# EAGLE schematic Main-board (EAGLE 9.5.2)
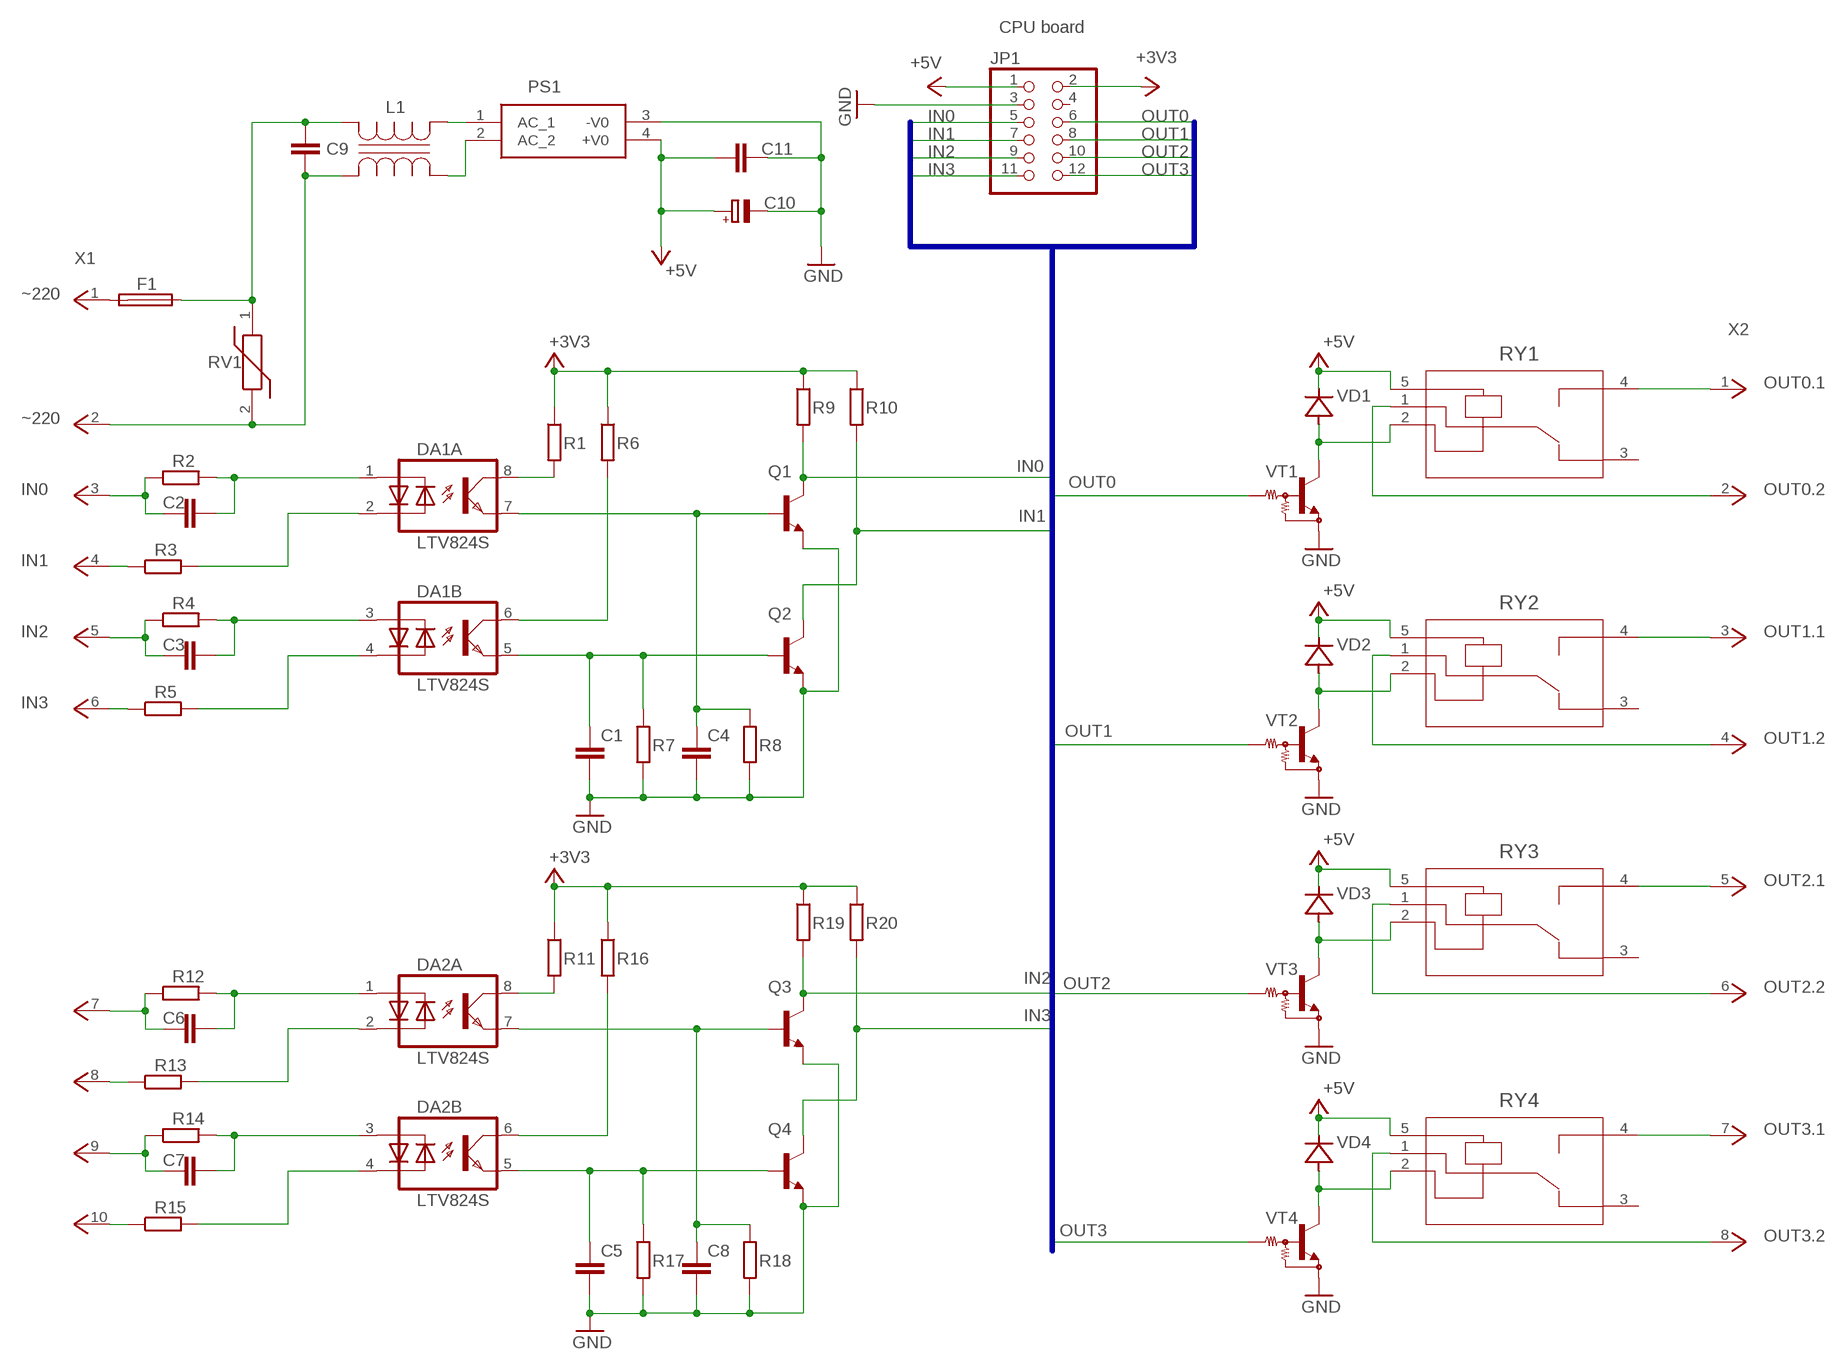
[diagram p0: schematic, sheet 1]

## Parts
C1  0,1u  C-EUC0603  [C0603]
C2  33n  C-EUC1812  [C1812]
C3  33n  C-EUC1812  [C1812]
C4  0,1u  C-EUC0603  [C0603]
C5  0,1u  C-EUC0603  [C0603]
C6  33n  C-EUC1812  [C1812]
C7  33n  C-EUC1812  [C1812]
C8  0,1u  C-EUC0603  [C0603]
C9  R46KI310000M1K  [CAP_R46KI310000M1K]
C10  220uF  CPOL-EUD/7343-31W  [D/7343-31W]
C11  0,1u  C-EUC0603  [C0603]
DA1  LTV824S  [DIL8-SMD]
DA2  LTV824S  [DIL8-SMD]
F1  0,5A  TR5  [TR5]
JP1  NOT INSTALLED  PINHD-2X6  [2X06]
L1  DLW5BSN152SQ2L  [IND_DLW5BS_2020]
PS1  HLK-10M05  [HLK10M05]
Q1  BC847ALT1SMD  [SOT23]
Q2  BC847ALT1SMD  [SOT23]
Q3  BC847ALT1SMD  [SOT23]
Q4  BC847ALT1SMD  [SOT23]
R1  2,2k  R-EU_R0603  [R0603]
R2  330k  R-EU_R2512  [R2512]
R3  51  R-EU_R2512  [R2512]
R4  330 k  R-EU_R2512  [R2512]
R5  51  R-EU_R2512  [R2512]
R6  2,2k  R-EU_R0603  [R0603]
R7  33k  R-EU_R0603  [R0603]
R8  33k  R-EU_R0603  [R0603]
R9  10k  R-EU_R0603  [R0603]
R10  10k  R-EU_R0603  [R0603]
R11  2,2k  R-EU_R0603  [R0603]
R12  330k  R-EU_R2512  [R2512]
R13  51  R-EU_R2512  [R2512]
R14  330 k  R-EU_R2512  [R2512]
R15  51  R-EU_R2512  [R2512]
R16  2,2k  R-EU_R0603  [R0603]
R17  33k  R-EU_R0603  [R0603]
R18  33k  R-EU_R0603  [R0603]
R19  10k  R-EU_R0603  [R0603]
R20  10k  R-EU_R0603  [R0603]
RV1  VDR-10D561KJ  [VDR10D561KJ]
RY1  SRD-05VDC-SL-C  [RELAY_SRD-05VDC-SL-C]
RY2  SRD-05VDC-SL-C  [RELAY_SRD-05VDC-SL-C]
RY3  SRD-05VDC-SL-C  [RELAY_SRD-05VDC-SL-C]
RY4  SRD-05VDC-SL-C  [RELAY_SRD-05VDC-SL-C]
VD1  LL4148  [SOD80C]
VD2  LL4148  [SOD80C]
VD3  LL4148  [SOD80C]
VD4  LL4148  [SOD80C]
VT1  BCR108E6327  [SOT23_1]
VT2  BCR108E6327  [SOT23_1]
VT3  BCR108E6327  [SOT23_1]
VT4  BCR108E6327  [SOT23_1]
X1  2EHDCR-5.08-10P  [2EHDCR-5.08-10P]
X2  2EHDCR-5.08-08P  [2EHDCR-5.08-08P]

## Nets
+3V3: JP1.2 R1.1 R6.1 R9.1 R10.1 R11.1 R16.1 R19.1 R20.1
+5V: C10.+ C11.1 JP1.1 PS1.4(+V0) RY1.5 RY2.5 RY3.5 RY4.5 VD1.C VD2.C VD3.C VD4.C
GND: C1.2 C4.2 C5.2 C8.2 C10.- C11.2 JP1.3 PS1.3(-V0) Q1.2(E) Q2.2(E) Q3.2(E) Q4.2(E) R7.2 R8.2 R17.2 R18.2 VT1.2 VT2.2 VT3.2 VT4.2
IN0: JP1.5 Q1.3(C) R9.2
IN1: JP1.7 Q2.3(C) R10.2
IN2: JP1.9 Q3.3(C) R19.2
IN3: JP1.11 Q4.3(C) R20.2
N$1: C2.1 R2.1 X1.3
N$2: C2.2 DA1.1(A:A) R2.2
N$3: DA1.2(A:C) R3.2
N$4: R3.1 X1.4
N$5: C3.1 R4.1 X1.5
N$6: C3.2 DA1.3(B:A) R4.2
N$7: DA1.4(B:C) R5.2
N$8: R5.1 X1.6
N$9: DA1.8(A:COL) R1.2
N$10: DA1.6(B:COL) R6.2
N$11: C1.1 DA1.5(B:EMIT) Q2.1(B) R7.1
N$12: C9.2 F1.1 L1.1 RV1.1
N$13: L1.2 PS1.1(AC_1)
N$14: C4.1 DA1.7(A:EMIT) Q1.1(B) R8.1
N$15: L1.3 PS1.2(AC_2)
N$16: F1.2 X1.1
N$17: C6.1 R12.1 X1.7
N$18: C6.2 DA2.1(A:A) R12.2
N$19: DA2.2(A:C) R13.2
N$20: C7.1 R14.1 X1.9
N$21: C7.2 DA2.3(B:A) R14.2
N$22: DA2.4(B:C) R15.2
N$23: DA2.8(A:COL) R11.2
N$24: DA2.6(B:COL) R16.2
N$25: C5.1 DA2.5(B:EMIT) Q4.1(B) R17.1
N$26: C9.1 L1.4 RV1.2 X1.2
N$28: C8.1 DA2.7(A:EMIT) Q3.1(B) R18.1
N$31: R13.1 X1.8
N$32: R15.1 X1.10
N$33: RY2.2 VD2.A VT2.3
N$34: RY1.2 VD1.A VT1.3
N$35: RY3.2 VD3.A VT3.3
N$36: RY4.2 VD4.A VT4.3
N$37: RY1.4 X2.1
N$38: RY1.1 X2.2
N$39: RY2.4 X2.3
N$40: RY2.1 X2.4
N$41: RY3.4 X2.5
N$42: RY3.1 X2.6
N$43: RY4.4 X2.7
N$44: RY4.1 X2.8
OUT0: JP1.6 VT1.1
OUT1: JP1.8 VT2.1
OUT2: JP1.10 VT3.1
OUT3: JP1.12 VT4.1
Unconnected: JP1.4 RY1.3 RY2.3 RY3.3 RY4.3

## Buses
IN[0..3],OUT[0..3]

## Notes on the sheet
- CPU board
- X1
- ~220
- X2
- OUT0.1
- ~220
- IN0 | OUT0.2
- IN1
- IN2 | OUT1.1
- IN3
- OUT1.2
- OUT2.1
- OUT2.2
- OUT3.1
- OUT3.2

## Library data of the parts
C1 C4 C5 C8 C11 = rcl:C-EU: CAPACITOR, European symbol; SPICEPREFIX: C; STYPE: X7R; VOLTAGE: 50V
C2 C3 C6 C7 = rcl:C-EU: CAPACITOR, European symbol; SPICEPREFIX: C; STYPE: X7R; VOLTAGE: 500V
C9 = My_lib:R46KI310000M1K; BUILT_BY: EMA_Cory; COPYRIGHT: Copyright (C) 2018 Accelerated Designs. All rights reserved; MANUFACTURER_PART_NUMBER: R46KI310000M1K; VENDOR: Kemet
C10 = rcl:CPOL-EU: POLARIZED CAPACITOR, European symbol; SPICEPREFIX: C; TOLERANCE: +/-10%; VOLTAGE: 10V
DA1 DA2 = My_lib:LTV824: OPTO COUPLER Source: LITEON, LTV816.pdf; OC_FARNELL: unknown; OC_NEWARK: unknown
F1 = fuse:TR5: FUSE Wickmann; OC_FARNELL: unknown; OC_NEWARK: unknown
JP1 = pinhead:PINHD-2X6: PIN HEADER
L1 = My_lib:DLW5BSN152SQ2L; BUILT_BY: EMA_UL_Team; MANUFACTURER_PART_NUMBER: DLW5BSN152SQ2L; VENDOR: Murata
PS1 = My_lib:HLK-10M05: Power Module AC-DC Through Hole RoHS Source: Datasheet <https://datasheet.lcsc.com/szlcsc/1909111105_HI-LINK-HLK-10M05_C403745.pdf>; DESCRIPTION: Power Module AC-DC Through Hole RoHS; HEIGHT: 21.8mm; MANUFACTURER_NAME: Hi-Link; MANUFACTURER_PART_NUMBER: HLK-10M05
Q1-Q4 = transistor-npn:BC847*: NPN Transistor
R1 R6-R11 R16-R20 = rcl:R-EU_: RESISTOR, European symbol; SPICEPREFIX: R; TOLERANCE: 1%
R2-R5 R12-R15 = rcl:R-EU_: RESISTOR, European symbol; SPICEPREFIX: R; TOLERANCE: 5%
RV1 = My_lib:VDR-10D561KJ: Varistors 460V 920V 3.5KA Through Hole RoHS Source: Datasheet <https://datasheet.lcsc.com/szlcsc/1810161222_VDR-Varistor-VDR-10D561KJ_C273560.pdf>; DESCRIPTION: Varistors 460V 920V 3.5KA Through Hole RoHS; HEIGHT: 17.5mm; MANUFACTURER_NAME: VDR Varistor; MANUFACTURER_PART_NUMBER: VDR-10D561KJ
RY1-RY4 = My_lib:SRD-05VDC-SL-C; BUILT_BY: EMA_Cory; COPYRIGHT: Copyright (C) 2018 Accelerated Designs. All rights reserved; MANUFACTURER_PART_NUMBER: SRD-05VDC-SL-C; VENDOR: MCM Electronics
VD1-VD4 = My_lib:LL4148
VT1-VT4 = My_lib:BCR108
X1 = My_lib:2EHDCR-5.08-10P
X2 = My_lib:2EHDCR-5.08-08P